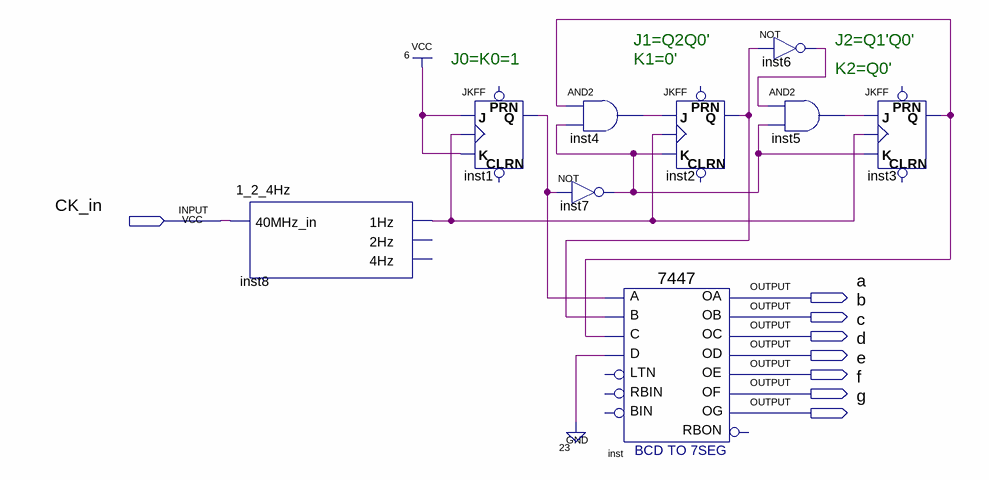
[diagram p0: schematic sheet]
// Quartus schematic 6_MOD_s_d_7447_test.bdf as structural Verilog: 9 symbols, 8 pins
module \6_MOD_s_d_7447_test  (
  input  CK_in,
  output a,
  output b,
  output c,
  output d,
  output e,
  output f,
  output g
);

  wire inst1_q, inst2_q, inst3_q, inst4_out, inst5_out, inst6_out, inst7_out, inst8_1hz;

  \1_2_4Hz  inst8 (.\40MHz_in (CK_in), .\1Hz (inst8_1hz));  // open: 2Hz, 4Hz
  JKFF inst1 (.K(1'b1), .J(1'b1), .CLK(inst8_1hz), .Q(inst1_q));  // open: PRN, CLRN
  and inst4 (inst4_out, inst3_q, inst7_out);
  not inst7 (inst7_out, inst1_q);
  \7447  inst (
    .B(inst2_q), .C(inst3_q), .D(1'b0), .A(inst1_q), .OB(b), .OC(c), .OE(e), .OD(d), .OF(f), .OG(g), .OA(a));  // open: LTN, RBIN, BIN, RBON
  JKFF inst2 (.K(inst7_out), .J(inst4_out), .CLK(inst8_1hz), .Q(inst2_q));  // open: PRN, CLRN
  not inst6 (inst6_out, inst2_q);
  and inst5 (inst5_out, inst6_out, inst7_out);
  JKFF inst3 (.K(inst7_out), .J(inst5_out), .CLK(inst8_1hz), .Q(inst3_q));  // open: PRN, CLRN

  // Notes on the sheet:
  //   J1=Q2Q0'
  //   J2=Q1'Q0'
  //   J0=K0=1
  //   K1=0'
  //   K2=Q0'
endmodule
